# EAGLE design picstick_uart_rpi4 (EAGLE 7.2.0)
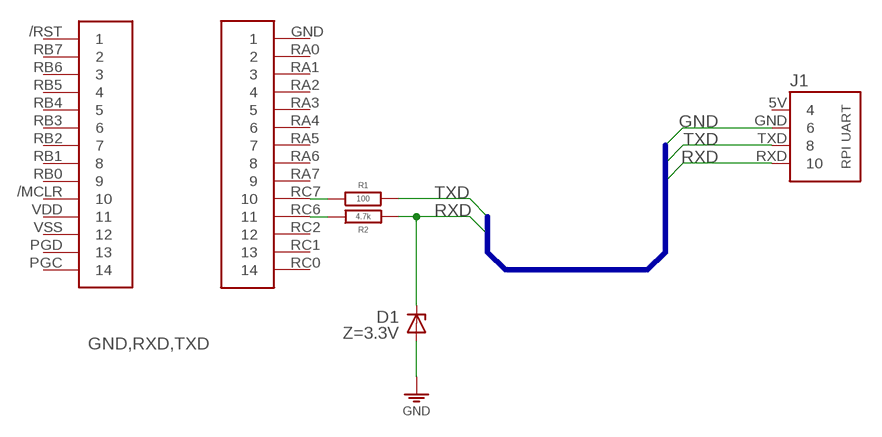
[diagram p0: schematic, sheet 1]

## Parts
D1  Z=3.3V  Z-DIODE34Z10  [DO34Z10]
J1  RPI-UART-RPI4  [RPI-UART]
J2  PICSTICK  [PICSTICK_ALT]
R1  100  R-H0204/12  [0204/12]
R2  4.7k  R-H0204/12  [0204/12]

## Nets
GND: D1.A J1.GND
N$1: J2.RC7 R1.1
N$2: J2.RC6 R2.1
RXD: D1.C J1.RXD R2.2
TXD: J1.TXD R1.2
Unconnected: J1.5V J2./MCLR J2./RST J2.GND J2.PGC J2.PGD J2.RA0 J2.RA1 J2.RA2 J2.RA3 J2.RA4 J2.RA5 J2.RA6 J2.RA7 J2.RB0 J2.RB1 J2.RB2 J2.RB3 J2.RB4 J2.RB5 J2.RB6 J2.RB7 J2.RC0 J2.RC1 J2.RC2 J2.VDD J2.VSS

## Buses
GND,RXD,TXD

## Library data of the parts
D1 = d:Z-DIODE
J1 = pinconn:RPI-UART
J2 = pinconn:PICSTICK
R1 R2 = r:R-H

## Board
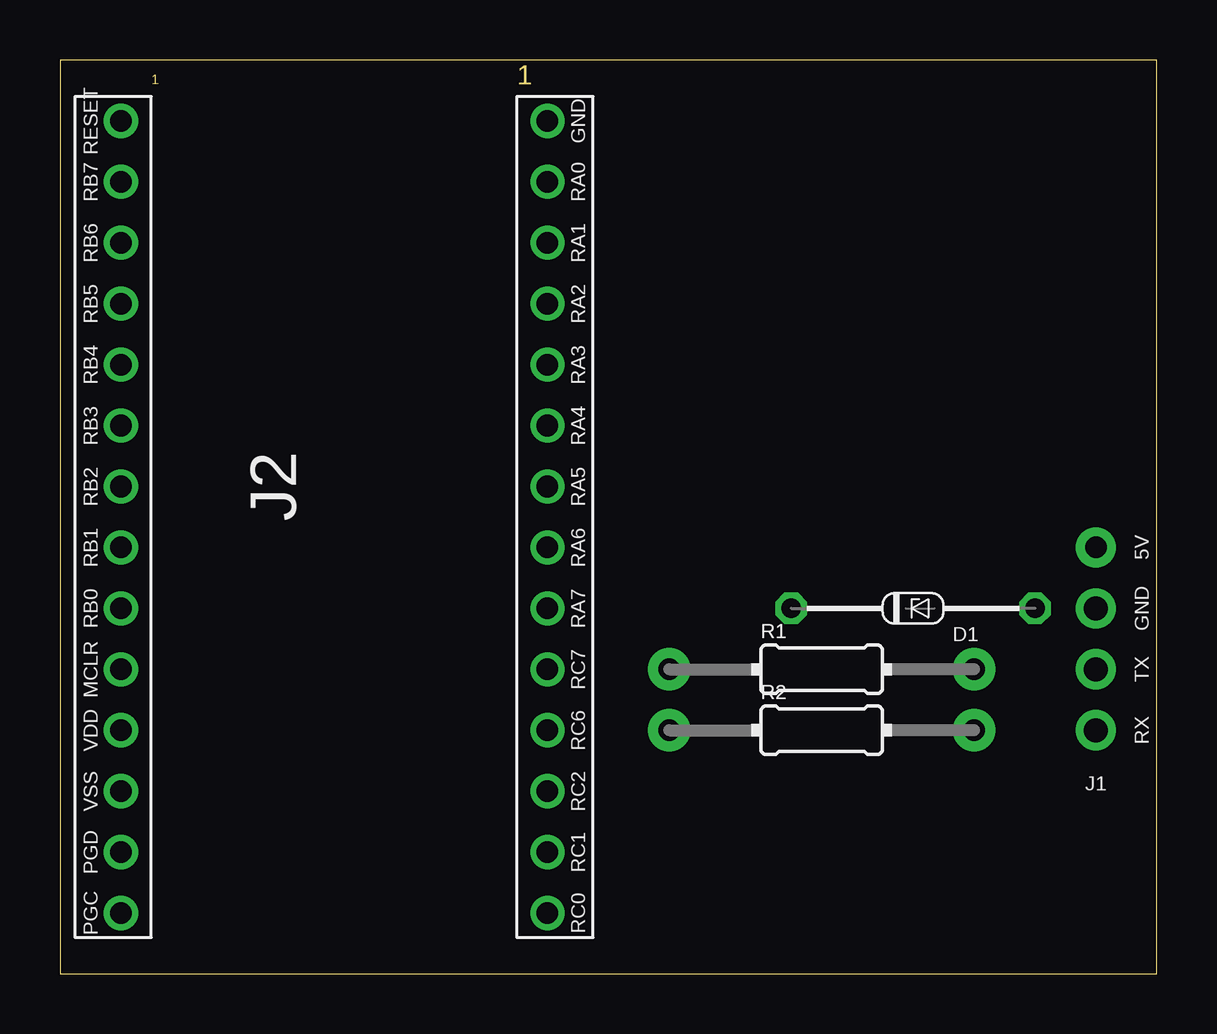
[diagram p1: board, top side]
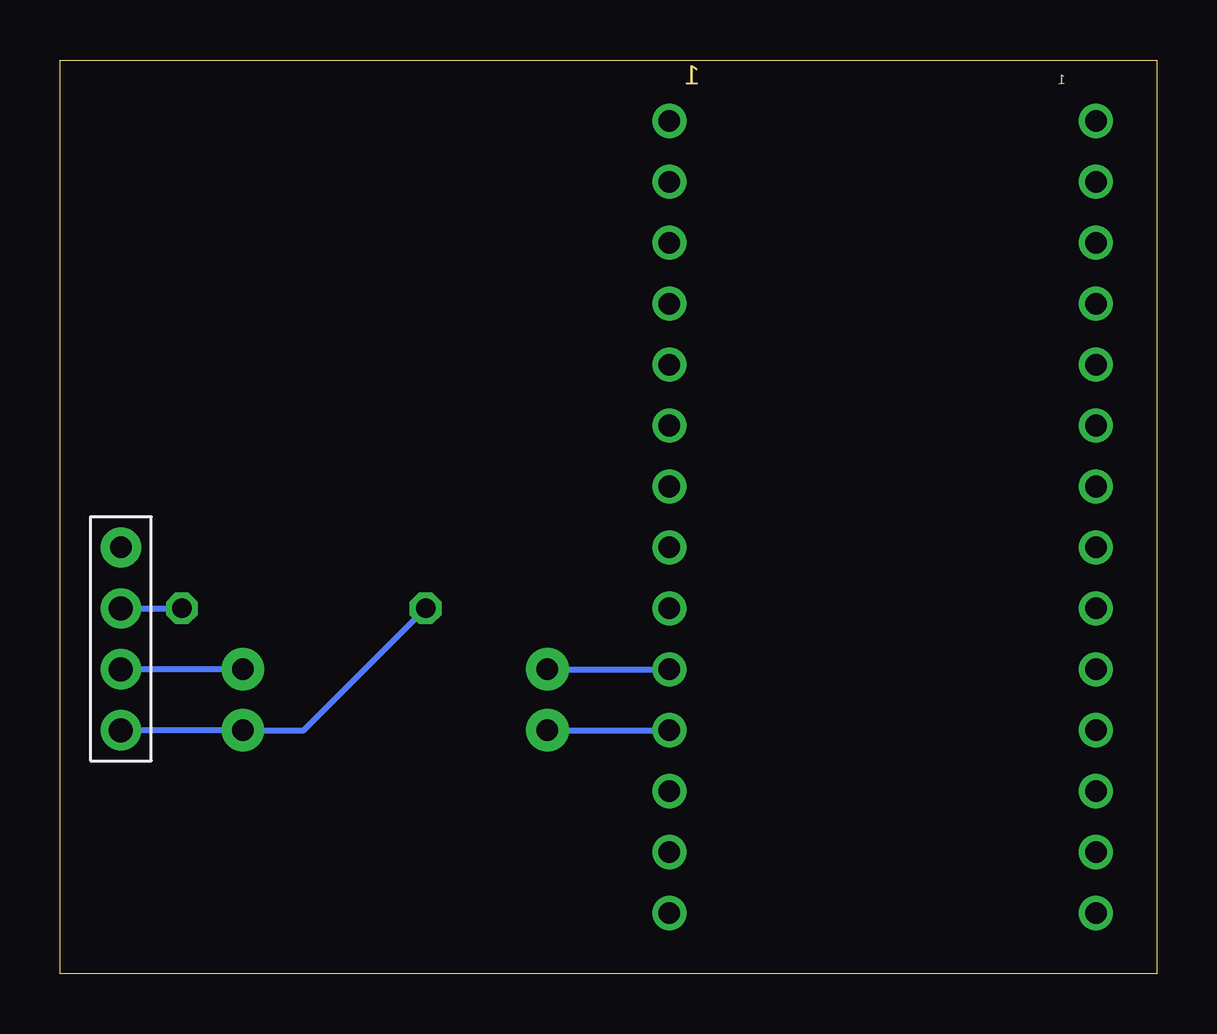
[diagram p2: board, bottom side, seen from below]

Size 45.72 x 38.1 mm. Coordinates in mm from the lower left corner, seen from the top.
Outline: 0,0 45.72,0 45.72,38.1 0,38.1 0,0
Copper layers (1*16): Top 0.035mm / dielectric 1.5mm / Bottom 0.035mm
Design rules "default": minimum track width 10mil, minimum drill 24mil, track to track 8mil, track to pad 8mil, pad to pad 8mil, via to via 8mil, smd to smd 8mil, copper to edge 40mil, drill to drill 8mil, minimum pad ring 10mil, minimum via ring 8mil, stop-mask expansion 4mil, vias tented up to drill 0mil, thermal gap 10mil

### Footprints (pad centres in the part's own frame; a part is rotated, then mirrored left to right if it is on the bottom)
DO34Z10 = drill 0.813 octagon: A -5.08,0; C 5.08,0
RPI-UART = drill 0.9 pad 1.676: 5V 0,2.54 | drill 1 pad 1.676: GND 0,0; RXD 0,-5.08; TXD 0,-2.54
PICSTICK_ALT = drill 0.9 pad 1.422: /MCLR -7.62,-7.62; /RST -7.62,15.24; GND 10.16,15.24; PGC -7.62,-17.78; PGD -7.62,-15.24; RA0 10.16,12.7; RA1 10.16,10.16; RA2 10.16,7.62; RA3 10.16,5.08; RA4 10.16,2.54; RA5 10.16,0; RA6 10.16,-2.54; RA7 10.16,-5.08; RB0 -7.62,-5.08; RB1 -7.62,-2.54; RB2 -7.62,0; RB3 -7.62,2.54; RB4 -7.62,5.08; RB5 -7.62,7.62; RB6 -7.62,10.16; RB7 -7.62,12.7; RC0 10.16,-17.78; RC1 10.16,-15.24; RC2 10.16,-12.7; RC6 10.16,-10.16; RC7 10.16,-7.62; VDD -7.62,-10.16; VSS -7.62,-12.7
0204/12 = drill 0.9 pad 1.778: 1 -6.35,0; 2 6.35,0

### Placement (x,y rotation side)
D1  35.56,15.24 180 top
J1  43.18,15.24 0 top
J2  10.16,20.32 0 top
R1  31.75,12.7 0 top
R2  31.75,10.16 0 top

### Tracks (layer width: path | path; a pad name or v marks a point on that pad's centre or on a via)
GND
  Bottom 0.254: J1.GND D1.A
N$1
  Bottom 0.254: R1.1 J2.RC7
N$2
  Bottom 0.254: R2.1 J2.RC6
RXD
  Bottom 0.254: D1.C 35.56,10.16 R2.2 J1.RXD
TXD
  Bottom 0.254: R1.2 J1.TXD